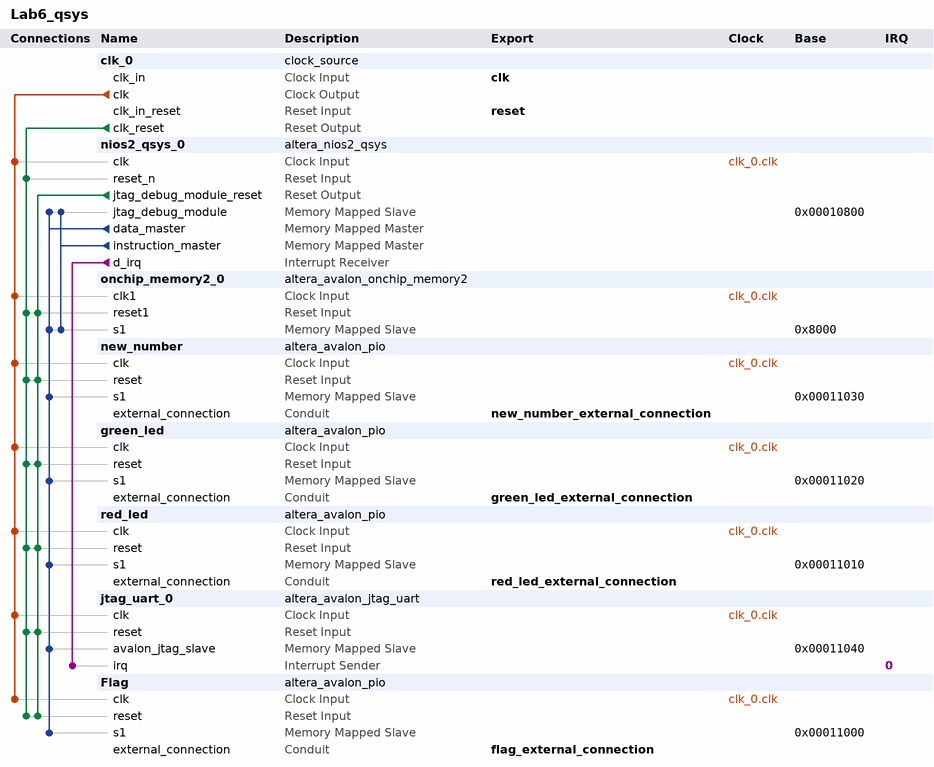
[diagram p0: system contents]
# Platform Designer (Qsys) system Lab6_qsys, Cyclone II EP2C35F672C6
# Parameters at their usual value, and those the tool derives, are not listed.
package require -exact qsys 13.0.1.99.2
create_system Lab6_qsys
set_project_property DEVICE_FAMILY {Cyclone II}
set_project_property DEVICE EP2C35F672C6

add_instance clk_0 clock_source 13.0
set_instance_parameter_value clk_0 clockFrequency 50000000

add_instance nios2_qsys_0 altera_nios2_qsys 13.0
set_instance_parameter_value nios2_qsys_0 resetSlave onchip_memory2_0.s1
set_instance_parameter_value nios2_qsys_0 mmu_TLBMissExcSlave None
set_instance_parameter_value nios2_qsys_0 exceptionSlave onchip_memory2_0.s1
set_instance_parameter_value nios2_qsys_0 breakSlave nios2_qsys_0.jtag_debug_module
set_instance_parameter_value nios2_qsys_0 impl Tiny
set_instance_parameter_value nios2_qsys_0 icache_size 4096

add_instance onchip_memory2_0 altera_avalon_onchip_memory2 13.0.1.99.2
set_instance_parameter_value onchip_memory2_0 dataWidth 32
set_instance_parameter_value onchip_memory2_0 dualPort false
set_instance_parameter_value onchip_memory2_0 initMemContent true
set_instance_parameter_value onchip_memory2_0 initializationFileName onchip_mem.hex
set_instance_parameter_value onchip_memory2_0 memorySize 32000

add_instance new_number altera_avalon_pio 13.0.1.99.2
set_instance_parameter_value new_number direction Input
set_instance_parameter_value new_number width 8

add_instance green_led altera_avalon_pio 13.0.1.99.2
set_instance_parameter_value green_led direction Output
set_instance_parameter_value green_led width 8

add_instance red_led altera_avalon_pio 13.0.1.99.2
set_instance_parameter_value red_led direction Output
set_instance_parameter_value red_led width 16

add_instance jtag_uart_0 altera_avalon_jtag_uart 13.0.1.99.2
set_instance_parameter_value jtag_uart_0 simInteractiveOptions NO_INTERACTIVE_WINDOWS

add_instance Flag altera_avalon_pio 13.0.1.99.2
set_instance_parameter_value Flag captureEdge true
set_instance_parameter_value Flag direction Input
set_instance_parameter_value Flag edgeType FALLING
set_instance_parameter_value Flag irqType EDGE
set_instance_parameter_value Flag width 1

# connections
add_connection clk_0.clk Flag.clk clock
add_connection clk_0.clk green_led.clk clock
add_connection clk_0.clk jtag_uart_0.clk clock
add_connection clk_0.clk new_number.clk clock
add_connection clk_0.clk nios2_qsys_0.clk clock
add_connection clk_0.clk onchip_memory2_0.clk1 clock
add_connection clk_0.clk red_led.clk clock
add_connection clk_0.clk_reset Flag.reset reset
add_connection clk_0.clk_reset green_led.reset reset
add_connection clk_0.clk_reset jtag_uart_0.reset reset
add_connection clk_0.clk_reset new_number.reset reset
add_connection clk_0.clk_reset nios2_qsys_0.reset_n reset
add_connection clk_0.clk_reset onchip_memory2_0.reset1 reset
add_connection clk_0.clk_reset red_led.reset reset
add_connection nios2_qsys_0.jtag_debug_module_reset Flag.reset reset
add_connection nios2_qsys_0.jtag_debug_module_reset green_led.reset reset
add_connection nios2_qsys_0.jtag_debug_module_reset jtag_uart_0.reset reset
add_connection nios2_qsys_0.jtag_debug_module_reset new_number.reset reset
add_connection nios2_qsys_0.jtag_debug_module_reset onchip_memory2_0.reset1 reset
add_connection nios2_qsys_0.jtag_debug_module_reset red_led.reset reset
add_connection nios2_qsys_0.data_master Flag.s1 avalon
set_connection_parameter_value nios2_qsys_0.data_master/Flag.s1 baseAddress 0x00011000
add_connection nios2_qsys_0.data_master green_led.s1 avalon
set_connection_parameter_value nios2_qsys_0.data_master/green_led.s1 baseAddress 0x00011020
add_connection nios2_qsys_0.data_master jtag_uart_0.avalon_jtag_slave avalon
set_connection_parameter_value nios2_qsys_0.data_master/jtag_uart_0.avalon_jtag_slave baseAddress 0x00011040
add_connection nios2_qsys_0.data_master new_number.s1 avalon
set_connection_parameter_value nios2_qsys_0.data_master/new_number.s1 baseAddress 0x00011030
add_connection nios2_qsys_0.data_master nios2_qsys_0.jtag_debug_module avalon
set_connection_parameter_value nios2_qsys_0.data_master/nios2_qsys_0.jtag_debug_module baseAddress 0x00010800
add_connection nios2_qsys_0.data_master onchip_memory2_0.s1 avalon
set_connection_parameter_value nios2_qsys_0.data_master/onchip_memory2_0.s1 baseAddress 0x8000
add_connection nios2_qsys_0.data_master red_led.s1 avalon
set_connection_parameter_value nios2_qsys_0.data_master/red_led.s1 baseAddress 0x00011010
add_connection nios2_qsys_0.instruction_master nios2_qsys_0.jtag_debug_module avalon
set_connection_parameter_value nios2_qsys_0.instruction_master/nios2_qsys_0.jtag_debug_module baseAddress 0x00010800
add_connection nios2_qsys_0.instruction_master onchip_memory2_0.s1 avalon
set_connection_parameter_value nios2_qsys_0.instruction_master/onchip_memory2_0.s1 baseAddress 0x8000
add_connection nios2_qsys_0.d_irq jtag_uart_0.irq interrupt
set_connection_parameter_value nios2_qsys_0.d_irq/jtag_uart_0.irq irqNumber 0

# exported interfaces
add_interface clk clock sink
set_interface_property clk EXPORT_OF clk_0.clk_in
add_interface reset reset sink
set_interface_property reset EXPORT_OF clk_0.clk_in_reset
add_interface new_number_external_connection conduit end
set_interface_property new_number_external_connection EXPORT_OF new_number.external_connection
add_interface green_led_external_connection conduit end
set_interface_property green_led_external_connection EXPORT_OF green_led.external_connection
add_interface red_led_external_connection conduit end
set_interface_property red_led_external_connection EXPORT_OF red_led.external_connection
add_interface flag_external_connection conduit end
set_interface_property flag_external_connection EXPORT_OF Flag.external_connection

set_interconnect_requirement {$system} qsys_mm.clockCrossingAdapter HANDSHAKE
set_interconnect_requirement {$system} qsys_mm.maxAdditionalLatency 1

save_system Lab6_qsys.qsys
